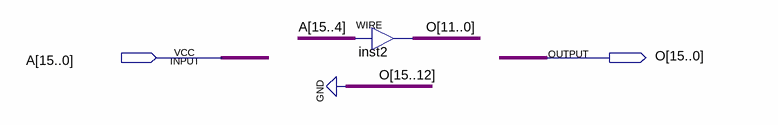
[diagram p0: schematic sheet]
// Quartus schematic srrrr.bdf as structural Verilog: 1 symbols, 2 pins
module srrrr (
  input  [15:0] A,
  output [15:0] O
);

  assign O[11:0] = A[15:4];  // WIRE inst2

  assign O[15:12] = 4'b0000;
endmodule
